# EAGLE design AVR_ISP-Shield-v11 (EAGLE 6.0)
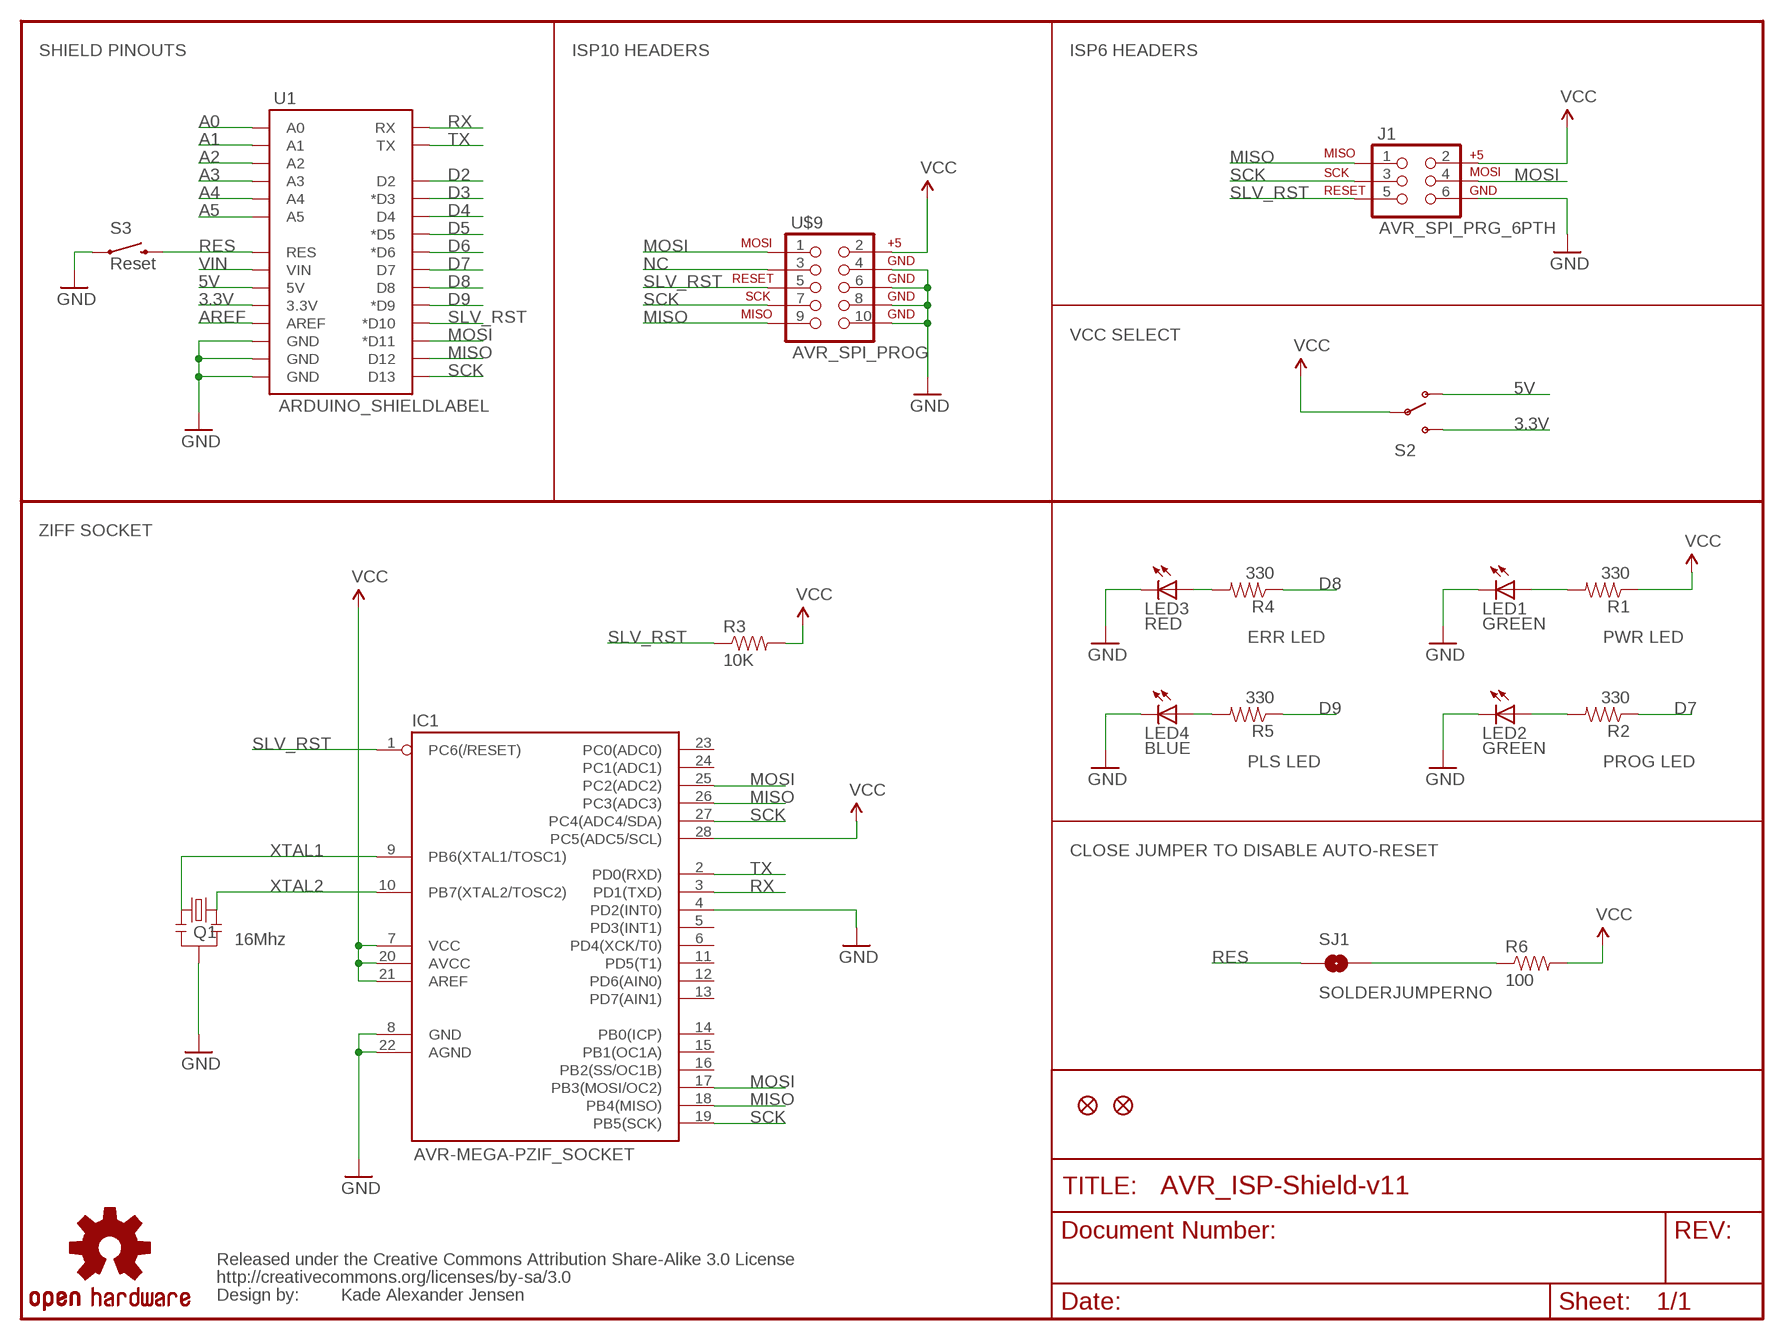
[diagram p0: schematic, sheet 1]

## Parts
$$U$1  CREATIVE_COMMONS  [CREATIVE_COMMONS]
IC1  AVR-MEGA-PZIF_SOCKET  AVR-MEGA8-PZIF_SOCKET  [DIL28-3-ZIF_SOCKET]
J1  AVR_SPI_PRG_6PTH  [2X3]
JP5  FIDUCIAL1X2.5  [FIDUCIAL-1X2.5]
JP6  FIDUCIAL1X2.5  [FIDUCIAL-1X2.5]
LED1  GREEN  LED0603  [LED-0603]
LED2  GREEN  LED0603  [LED-0603]
LED3  RED  LED0603  [LED-0603]
LED4  BLUE  LED0603  [LED-0603]
Q1  8/16/20MHz  RESONATORSMD  [RESONATOR-SMD]
R1  330  RESISTOR0402-RES  [0402-RES]
R2  330  RESISTOR0402-RES  [0402-RES]
R3  10K  RESISTOR0402-RES  [0402-RES]
R4  330  RESISTOR0402-RES  [0402-RES]
R5  330  RESISTOR0402-RES  [0402-RES]
R6  100  RESISTOR0402-RES  [0402-RES]
S2  SWITCH-SPSTSMD  [AYZ0202]
S3  Reset  SWITCH-MOMENTARY-2SMD  [TACTILE_SWITCH_SMD]
SJ1  SOLDERJUMPERNO  [SJ_2S-NO]
U1  ARDUINO_SHIELDLABEL  [DUEMILANOVE_SHIELD]
U$4  OSHW-LOGOS  [OSHW-LOGO-S]
U$9  AVR_SPI_PROG  [AVR_ICSP]

## Nets
3.3V: S2.3(S) U1.3.3V
5V: S2.1(O) U1.5V
A0: U1.A0
A1: U1.A1
A2: U1.A2
A3: U1.A3
A4: U1.A4
A5: U1.A5
AREF: U1.AREF
D2: U1.D2
D3: U1.D3(*D3)
D4: U1.D4
D5: U1.D5(*D5)
D6: U1.D6(*D6)
D7: R2.1 U1.D7
D8: R4.1 U1.D8
D9: R5.1 U1.D9(*D9)
GND: IC1.4(PD2(INT0)) IC1.8(GND) IC1.22(AGND) J1.6 LED1.C LED2.C LED3.C LED4.C Q1.2 S3.1 U1.GND@0(GND) U1.GND@1(GND) U1.GND@2(GND) U$9.4 U$9.6 U$9.8 U$9.10
MISO: IC1.18(PB4(MISO)) IC1.26(PC3(ADC3)) J1.1 U1.D12 U$9.9
MOSI: IC1.17(PB3(MOSI/OC2)) IC1.25(PC2(ADC2)) J1.4 U1.D11(*D11) U$9.1
N$1: LED1.A R1.2
N$2: LED2.A R2.2
N$3: LED3.A R4.2
N$4: LED4.A R5.2
N$5: R6.1 SJ1.2
NC: U$9.3
RES: S3.3 SJ1.1 U1.RES
RX: IC1.3(PD1(TXD)) U1.RX
SCK: IC1.19(PB5(SCK)) IC1.27(PC4(ADC4/SDA)) J1.3 U1.D13 U$9.7
SLV_RST: IC1.1(PC6(/RESET)) J1.5 R3.1 U1.D10(*D10) U$9.5
TX: IC1.2(PD0(RXD)) U1.TX
VCC: IC1.7(VCC) IC1.20(AVCC) IC1.21(AREF) IC1.28(PC5(ADC5/SCL)) J1.2 R1.1 R3.2 R6.2 S2.2(P) U$9.2
VIN: U1.VIN
XTAL1: IC1.9(PB6(XTAL1/TOSC1)) Q1.3
XTAL2: IC1.10(PB7(XTAL2/TOSC2)) Q1.1
Unconnected: IC1.5(PD3(INT1)) IC1.6(PD4(XCK/T0)) IC1.11(PD5(T1)) IC1.12(PD6(AIN0)) IC1.13(PD7(AIN1)) IC1.14(PB0(ICP)) IC1.15(PB1(OC1A)) IC1.16(PB2(SS/OC1B)) IC1.23(PC0(ADC0)) IC1.24(PC1(ADC1))

## Notes on the sheet
- SHIELD PINOUTS | ISP10 HEADERS | ISP6 HEADERS
- VCC SELECT
- ZIFF SOCKET
- ERR LED | PWR LED
- PLS LED | PROG LED
- CLOSE JUMPER TO DISABLE AUTO-RESET
- 16Mhz
- Kade Alexander Jensen

## Library data of the parts
$$U$1 = SparkFun:CREATIVE_COMMONS
IC1 = SparkFun:AVR-MEGA8-P: MICROCONTROLLER 8 Kbytes FLASH 1 kbytes SRAM 512 bytes EEPROM USART 4-channel 10 bit ADC 2-channel 8 bit ADC
J1 = SparkFun:AVR_SPI_PRG_6: AVR ISP 6 Pin This is the reduced ISP connector for AVR programming. Common on Arduino. This footprint will take up less PCB space and can be used with a 10-pin to 6-pin adapter such as SKU: BOB-08508
JP5 JP6 = abes:FIDUCIAL: Fiducial Alignment Points Various fiducial points for machine vision alignment.
LED1-LED4 = SparkFun:LED: LEDs Standard schematic elements and footprints for 5mm, 3mm, 1206, and 0603 sized LEDs. 5mm - Spark Fun Electronics SKU : COM-00529 (and others)
Q1 = SparkFun:RESONATOR: Resonator Small SMD resonator. This is the itty bitty 10/20MHz resonators with built in caps. CSTCE10M0G55 and CSTCE20M0V53. Footprint has been reviewed closely but hasn't been tested yet.
R1-R6 = SparkFun:RESISTOR: Resistor Basic schematic elements and footprints for 0603, 1206, and PTH resistors.
S2 = Testing:SWITCH-SPST: SPST Switch Simple slide switch. Spark Fun Electronics SKU : COM-00102
S3 = SparkFun:SWITCH-MOMENTARY-2
SJ1 = SparkFun:SOLDERJUMPER: Solder Jumper Standard SMD solder jumper. Used to automate production. Two varients : Normally Open and Normally Closed are the same, but have different paste layers. NC will have a large amount of paste and should jumper during reflow.
U1 = SparkFun:ARDUINO_SHIELD
U$4 = SparkFun:OSHW-LOGO: Open Source Hardware Logo This logo indicates the piece of hardware it is found on incorporates a OSHW license and/or adheres to the definition of open source hardware found here: http://freedomdefined.org/OSHW
U$9 = SparkFun:AVR_SPI_PROG: AVR ICSP Header This is the standard AVR In Circuit Serial Programming header. Minimal, but includes pin one indicator. Works with standard Olimex programmers. Also look for the 6-pin reduced version. Spark Fun Electronics SKU: PRT-00778

## Net classes
1 vcc: width 0.254 mm

## Board
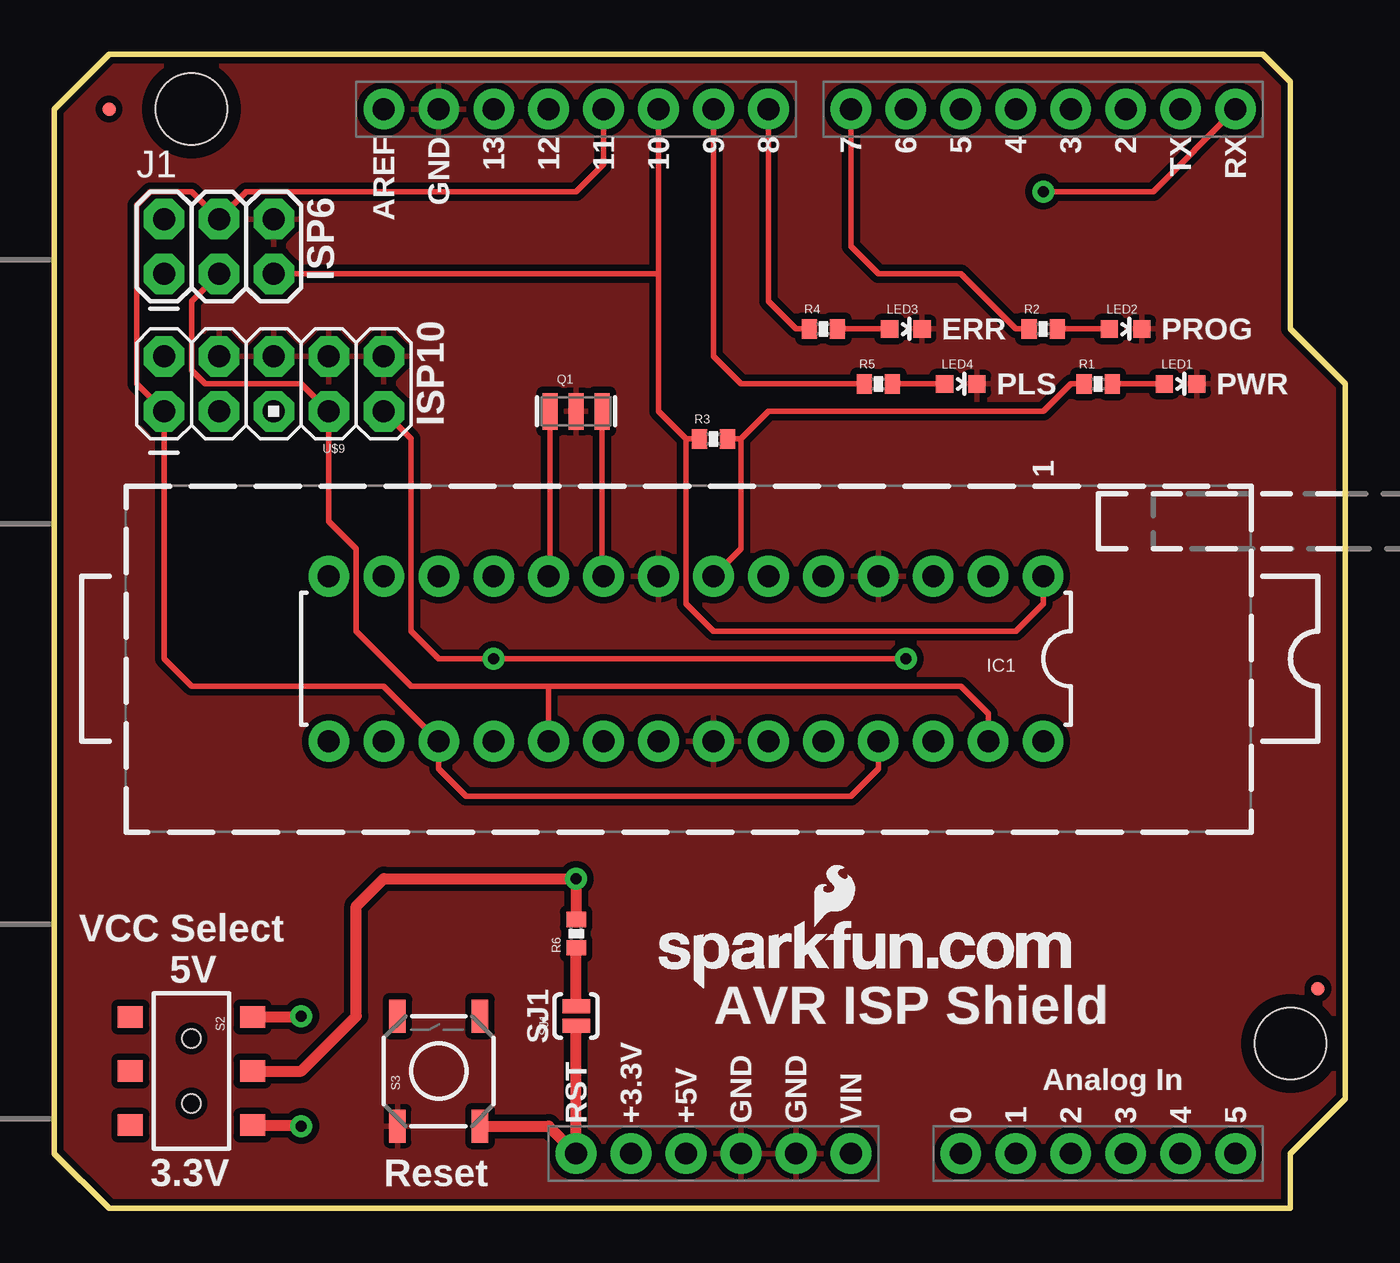
[diagram p1: board, top side]
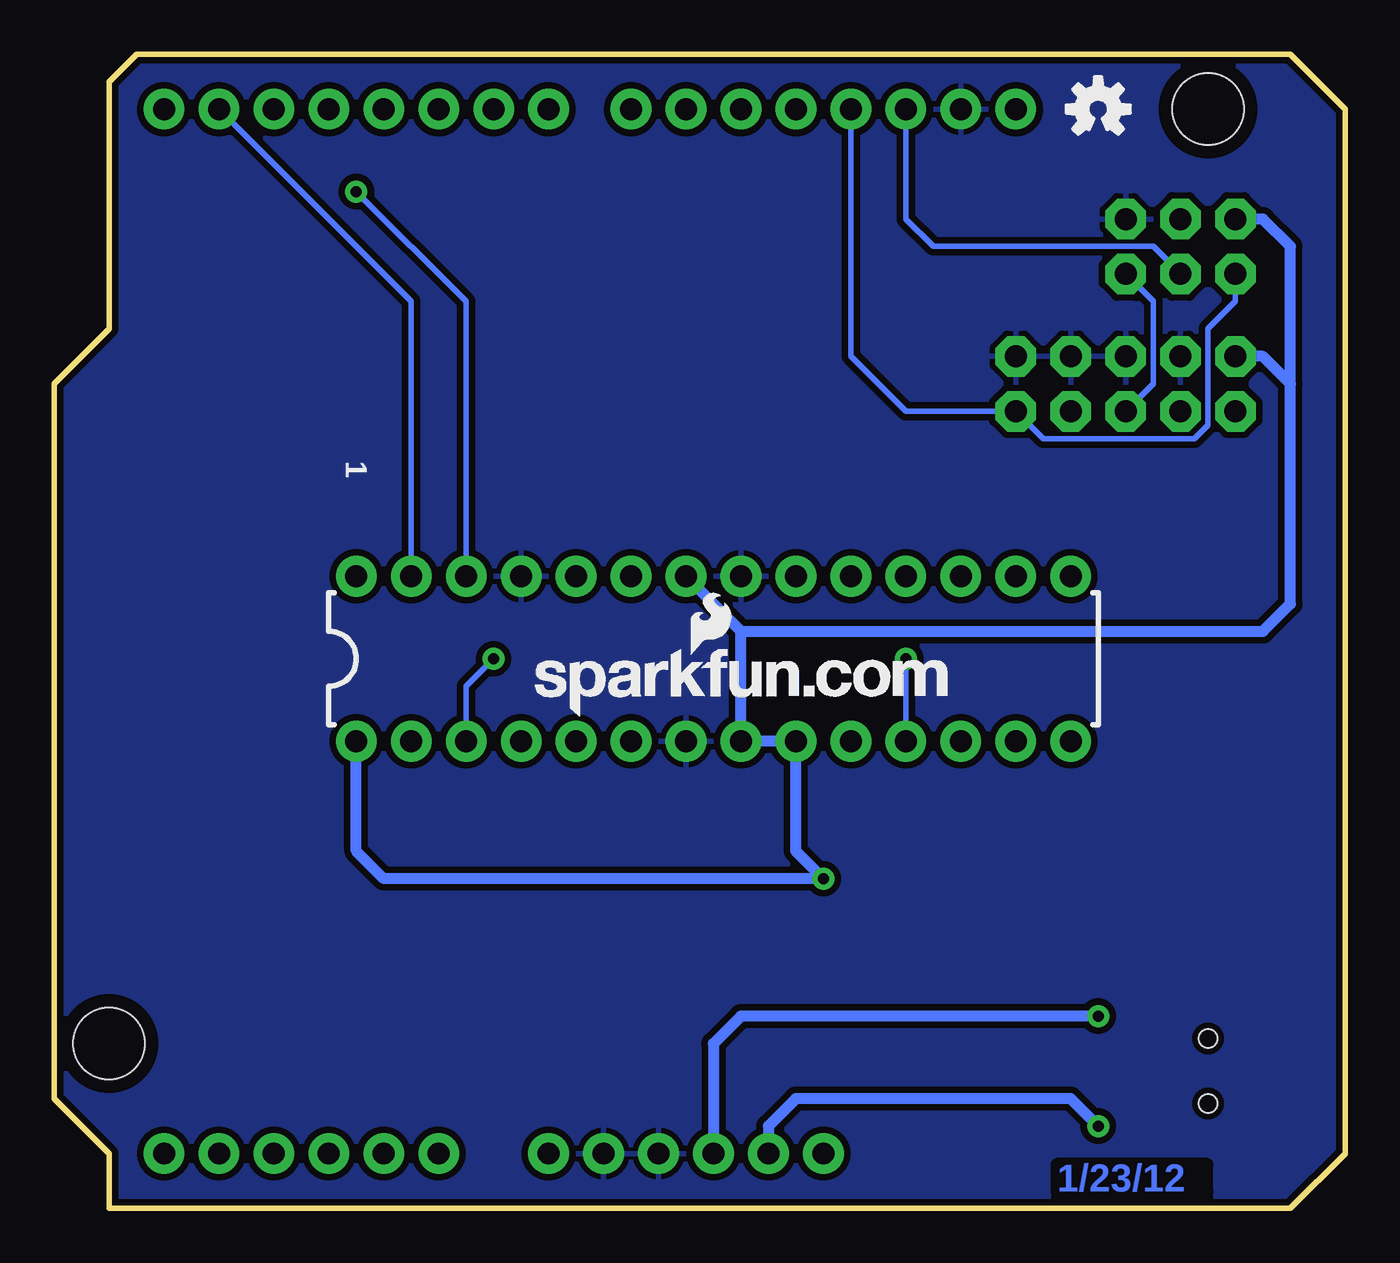
[diagram p2: board, bottom side, seen from below]

Size 59.69 x 53.34 mm. Coordinates in mm from the lower left corner, seen from the top.
Outline: 0,50.8 2.54,53.34 55.88,53.34 57.15,52.07 57.15,40.64 59.69,38.1 59.69,5.08 57.15,2.54 57.15,0 2.54,0 0,2.54 0,50.8
Copper layers (1*16): Top 0.035mm / dielectric 1.5mm / Bottom 0.035mm
Design rules: minimum track width 8mil, minimum drill 20mil, track to track 8mil, track to pad 8mil, pad to pad 8mil, via to via 8mil, smd to smd 8mil, copper to edge 8mil, drill to drill 8mil, minimum pad ring 12mil, minimum via ring 10mil, stop-mask expansion 4mil, vias tented up to drill 20mil, thermal gap 10mil

### Footprints (pad centres in the part's own frame; a part is rotated, then mirrored left to right if it is on the bottom)
DIL28-3-ZIF_SOCKET = drill 1.016 pad 1.88: 1 -16.51,-3.81; 2 -13.97,-3.81; 3 -11.43,-3.81; 4 -8.89,-3.81; 5 -6.35,-3.81; 6 -3.81,-3.81; 7 -1.27,-3.81; 8 1.27,-3.81; 9 3.81,-3.81; 10 6.35,-3.81; 11 8.89,-3.81; 12 11.43,-3.81; 13 13.97,-3.81; 14 16.51,-3.81; 15 16.51,3.81; 16 13.97,3.81; 17 11.43,3.81; 18 8.89,3.81; 19 6.35,3.81; 20 3.81,3.81; 21 1.27,3.81; 22 -1.27,3.81; 23 -3.81,3.81; 24 -6.35,3.81; 25 -8.89,3.81; 26 -11.43,3.81; 27 -13.97,3.81; 28 -16.51,3.81
2X3 = drill 1.016 pad 1.88 octagon: 1 0,0; 2 0,2.54; 3 2.54,0; 4 2.54,2.54; 5 5.08,0; 6 5.08,2.54
FIDUCIAL-1X2.5 = smd 0.635 x 0.635: 1 0,0
LED-0603 = smd 0.8 x 0.8: A 0,-0.75; C 0,0.75
RESONATOR-SMD = smd 0.7 x 1.7: 1 -1.2,0; 2 0,0; 3 1.2,0
0402-RES = smd 0.7 x 0.9: 1 -0.65,0; 2 0.65,0
AYZ0202 = smd 1 x 1.15: 1 -2.5,2.825; 2 0,2.825; 3 2.5,2.825; 4 -2.5,-2.825; 5 0,-2.825; 6 2.5,-2.825 | hole 0.85: 1.5,0; -1.5,0
TACTILE_SWITCH_SMD = smd 1.524 x 0.762: 1 -2.54,1.905; 2 2.54,1.905; 3 -2.54,-1.905; 4 2.54,-1.905
SJ_2S-NO = smd 0.635 x 1.27: 1 -0.45,0; 2 0.45,0
DUEMILANOVE_SHIELD = drill 1.016 pad 1.88: 3.3V 50.8,26.67; 5V 50.8,29.21; A0 50.8,41.91; A1 50.8,44.45; A2 50.8,46.99; A3 50.8,49.53; A4 50.8,52.07; A5 50.8,54.61; AREF 2.54,15.24; D2 2.54,49.53; D3 2.54,46.99; D4 2.54,44.45; D5 2.54,41.91; D6 2.54,39.37; D7 2.54,36.83; D8 2.54,33.02; D9 2.54,30.48; D10 2.54,27.94; D11 2.54,25.4; D12 2.54,22.86; D13 2.54,20.32; GND@0 50.8,31.75; GND@1 50.8,34.29; GND@2 2.54,17.78; RES 50.8,24.13; RX 2.54,54.61; TX 2.54,52.07; VIN 50.8,36.83 | hole 3.302: 45.72,57.15; 2.54,6.35
AVR_ICSP = drill 1.016 pad 1.88 octagon: 1 -1.27,5.08; 2 1.27,5.08; 3 -1.27,2.54; 4 1.27,2.54; 5 -1.27,0; 6 1.27,0; 7 -1.27,-2.54; 8 1.27,-2.54; 9 -1.27,-5.08; 10 1.27,-5.08

### Placement (x,y rotation side)
$$U$1  -1.27,-11.43 0 top  (outside the outline)
IC1  29.21,25.4 180 top
J1  5.08,43.18 0 top
JP5  58.42,10.16 0 top
JP6  2.54,50.8 0 top
LED1  52.07,38.1 270 top
LED2  49.53,40.64 270 top
LED3  39.37,40.64 270 top
LED4  41.91,38.1 270 top
Q1  24.13,36.83 0 top
R1  48.26,38.1 0 top
R2  45.72,40.64 0 top
R3  30.48,35.56 0 top
R4  35.56,40.64 0 top
R5  38.1,38.1 0 top
R6  24.13,12.7 90 top
S2  6.35,6.35 270 top
S3  17.78,6.35 90 top
SJ1  24.13,8.89 90 top
U1  0,53.34 270 top
U$4  11.43,50.8 0 bottom
U$7  [SFE-NEW-WEBLOGO]  37.47,22.73 0 bottom
U$9  10.16,38.1 90 top
U$12  [SFE-NEW-WEBLOGO]  27.94,10.16 0 top

### Tracks (layer width: path | path; a pad name or v marks a point on that pad's centre or on a via)
3.3V  (via drill 0.51)
  Top 0.508: S2.3 11.39,3.85 v11.43,3.81
  Bottom 0.508: v11.43,3.81 12.7,5.08 25.4,5.08 26.67,3.81 U1.3.3V
5V  (via drill 0.51)
  Top 0.508: S2.1 11.39,8.85 v11.43,8.89
  Bottom 0.508: v11.43,8.89 27.94,8.89 29.21,7.62 U1.5V
D7
  Top 0.254: U1.D7 36.83,44.45 38.1,43.18 41.91,43.18 44.45,40.64 R2.1
D8
  Top 0.254: R4.1 34.29,40.64 33.02,41.91 U1.D8
D9
  Top 0.254: U1.D9 30.48,39.37 31.75,38.1 R5.1
GND
  pour Top (isolate 0.305): 0,53.34 0,0 59.69,0 59.69,53.34
  pour Bottom (isolate 0.305): 0,53.34 0,0 59.69,0 59.69,53.34
MISO  (via drill 0.51)
  Top 0.254: U$9.9 16.51,35.56 16.51,26.67 17.78,25.4 v20.32,25.4 v39.37,25.4
  Bottom 0.254: v39.37,25.4 40.64,24.13 IC1.26 | J1.1 5.08,41.91 6.35,40.64 6.35,36.2 6.99,35.56 11.43,35.56 | 11.43,35.56 10.79,35.56 | U1.D12 22.86,39.37 20.32,36.83 U$9.9 13.97,35.56 11.43,35.56 | IC1.18 v20.32,25.4
MOSI
  Top 0.254: U1.D11 25.4,48.26 24.13,46.99 8.89,46.99 J1.4 6.35,46.99 4.45,46.99 3.81,46.35 3.81,38.1 U$9.1 5.08,25.4 6.35,24.13 15.24,24.13 IC1.17 17.78,20.32 19.05,19.05 36.83,19.05 38.1,20.32 IC1.25
N$1
  Top 0.254: R1.2 LED1.A
N$2
  Top 0.254: R2.2 LED2.A
N$3
  Top 0.254: R4.2 LED3.A
N$4
  Top 0.254: R5.2 LED4.A
N$5
  Top 0.508: SJ1.2 R6.1
RES
  Top 0.508: S3.3 22.86,3.81 U1.RES SJ1.1
RX  (via drill 0.51)
  Top 0.254: v45.72,46.99 50.8,46.99 U1.RX
  Bottom 0.254: IC1.3 40.64,41.91 v45.72,46.99
SCK
  Top 0.254: IC1.27 43.18,22.86 41.91,24.13 22.86,24.13 | J1.3 6.35,41.91 6.35,38.73 6.99,38.1 11.43,38.1 U$9.7 12.7,31.75 13.97,30.48 13.97,26.67 16.51,24.13 22.86,24.13 | 22.86,24.13 IC1.19
  Bottom 0.254: U1.D13 20.32,45.72 19.05,44.45 8.89,44.45 J1.3
SLV_RST
  Top 0.254: IC1.1 45.72,27.94 44.45,26.67 30.48,26.67 29.21,27.94 29.21,35.56 | 27.94,43.18 U1.D10 | 27.94,43.18 27.94,36.83 29.21,35.56 | J1.5 27.94,43.18 | 29.21,35.56 R3.1
  Bottom 0.254: J1.5 8.89,41.91 8.89,38.1 U$9.5
TX
  Bottom 0.254: IC1.2 43.18,41.91 U1.TX
VCC  (via drill 0.51)
  Top 0.254: R1.1 46.99,38.1 45.72,36.83 33.02,36.83 31.75,35.56 | IC1.7 31.75,30.48 31.75,35.56 | 31.75,35.56 R3.2
  Top 0.508: S2.2 11.43,6.35 13.97,8.89 13.97,13.97 15.24,15.24 v24.13,15.24 R6.2
  Bottom 0.508: 27.94,26.67 IC1.21 IC1.20 25.4,16.51 v24.13,15.24 44.45,15.24 45.72,16.51 IC1.28 | 27.94,26.67 3.81,26.67 2.54,27.94 2.54,38.1 | 27.94,26.67 IC1.7 | 2.54,38.1 3.81,39.37 U$9.2 | J1.2 3.81,45.72 2.54,44.45 2.54,38.1
XTAL1
  Top 0.254: Q1.3 25.33,29.28 IC1.9
XTAL2
  Top 0.254: Q1.1 22.93,29.28 IC1.10

### Text on the board
Bottom: 1/23/12
tPlace: ISP6 | ISP10 | ERR | PROG | PLS | PWR | 1 | VCC Select | 5V | AVR ISP Shield | SJ1 | 3.3V | Reset
bPlace: 1
tValues: Kade Alexander Jensen